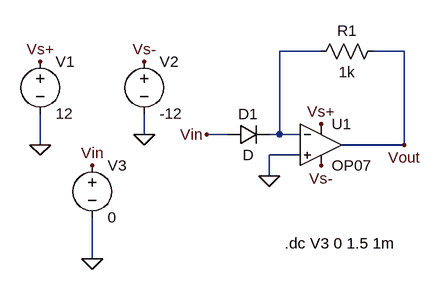
[diagram p0: schematic Expotential.asc]
Expotential.asc, the LTspice schematic file:
Version 4
SHEET 1 880 680
WIRE 384 48 320 48
WIRE 512 48 464 48
WIRE 112 176 112 144
WIRE 240 176 208 176
WIRE 320 176 320 48
WIRE 320 176 304 176
WIRE 352 176 320 176
WIRE -48 192 -48 144
WIRE 512 192 512 48
WIRE 512 192 416 192
WIRE 352 208 304 208
WIRE 304 240 304 208
WIRE 32 368 32 304
FLAG -48 192 0
FLAG 112 176 0
FLAG 32 368 0
FLAG 304 240 0
FLAG -48 64 Vs+
FLAG 384 160 Vs+
FLAG 112 64 Vs-
FLAG 384 224 Vs-
FLAG 32 224 Vin
FLAG 208 176 Vin
FLAG 512 192 Vout
SYMBOL voltage -48 48 R0
WINDOW 123 0 0 Left 0
WINDOW 39 0 0 Left 0
SYMATTR InstName V1
SYMATTR Value 12
SYMBOL voltage 112 48 R0
WINDOW 123 0 0 Left 0
WINDOW 39 0 0 Left 0
SYMATTR InstName V2
SYMATTR Value -12
SYMBOL voltage 32 208 R0
WINDOW 123 0 0 Left 0
WINDOW 39 0 0 Left 0
SYMATTR InstName V3
SYMATTR Value 0
SYMBOL OpAmps\\OP07 384 128 R0
SYMATTR InstName U1
SYMBOL res 480 32 R90
WINDOW 0 0 56 VBottom 2
WINDOW 3 32 56 VTop 2
SYMATTR InstName R1
SYMATTR Value 1k
SYMBOL diode 240 192 R270
WINDOW 0 32 32 VTop 2
WINDOW 3 0 32 VBottom 2
SYMATTR InstName D1
TEXT 328 344 Left 2 !.dc V3 0 1.5 1m

The netlist it stands for:
* Expotential.asc
V1 Vs+ 0 12
V2 Vs- 0 -12
V3 Vin 0 0
XU1 0 N001 Vs+ Vs- Vout LT1001  ; OP07, pins In+ In- V+ V- OUT
R1 Vout N001 1k
D1 Vin N001 D
.model D D
.lib standard.dio
.dc V3 0 1.5 1m
.lib LTC.lib
.backanno
.end